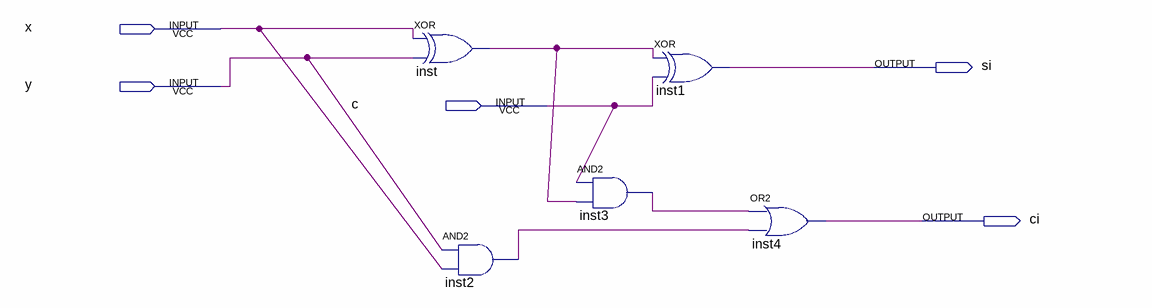
[diagram p0: schematic sheet]
// Quartus schematic Block2.bdf as structural Verilog: 5 symbols, 5 pins
module Block2 (
  input  x,
  input  y,
  input  c,
  output si,
  output ci
);

  wire inst2_out, inst3_out, inst_out;

  xor inst (inst_out, x, y);
  and inst2 (inst2_out, y, x);
  and inst3 (inst3_out, c, inst_out);
  xor inst1 (si, inst_out, c);
  or inst4 (ci, inst3_out, inst2_out);
endmodule
